# Altium schematic sheet Analog Voltmeter.SchDoc
size A2; SheetNumber: 1; SheetTotal: 1
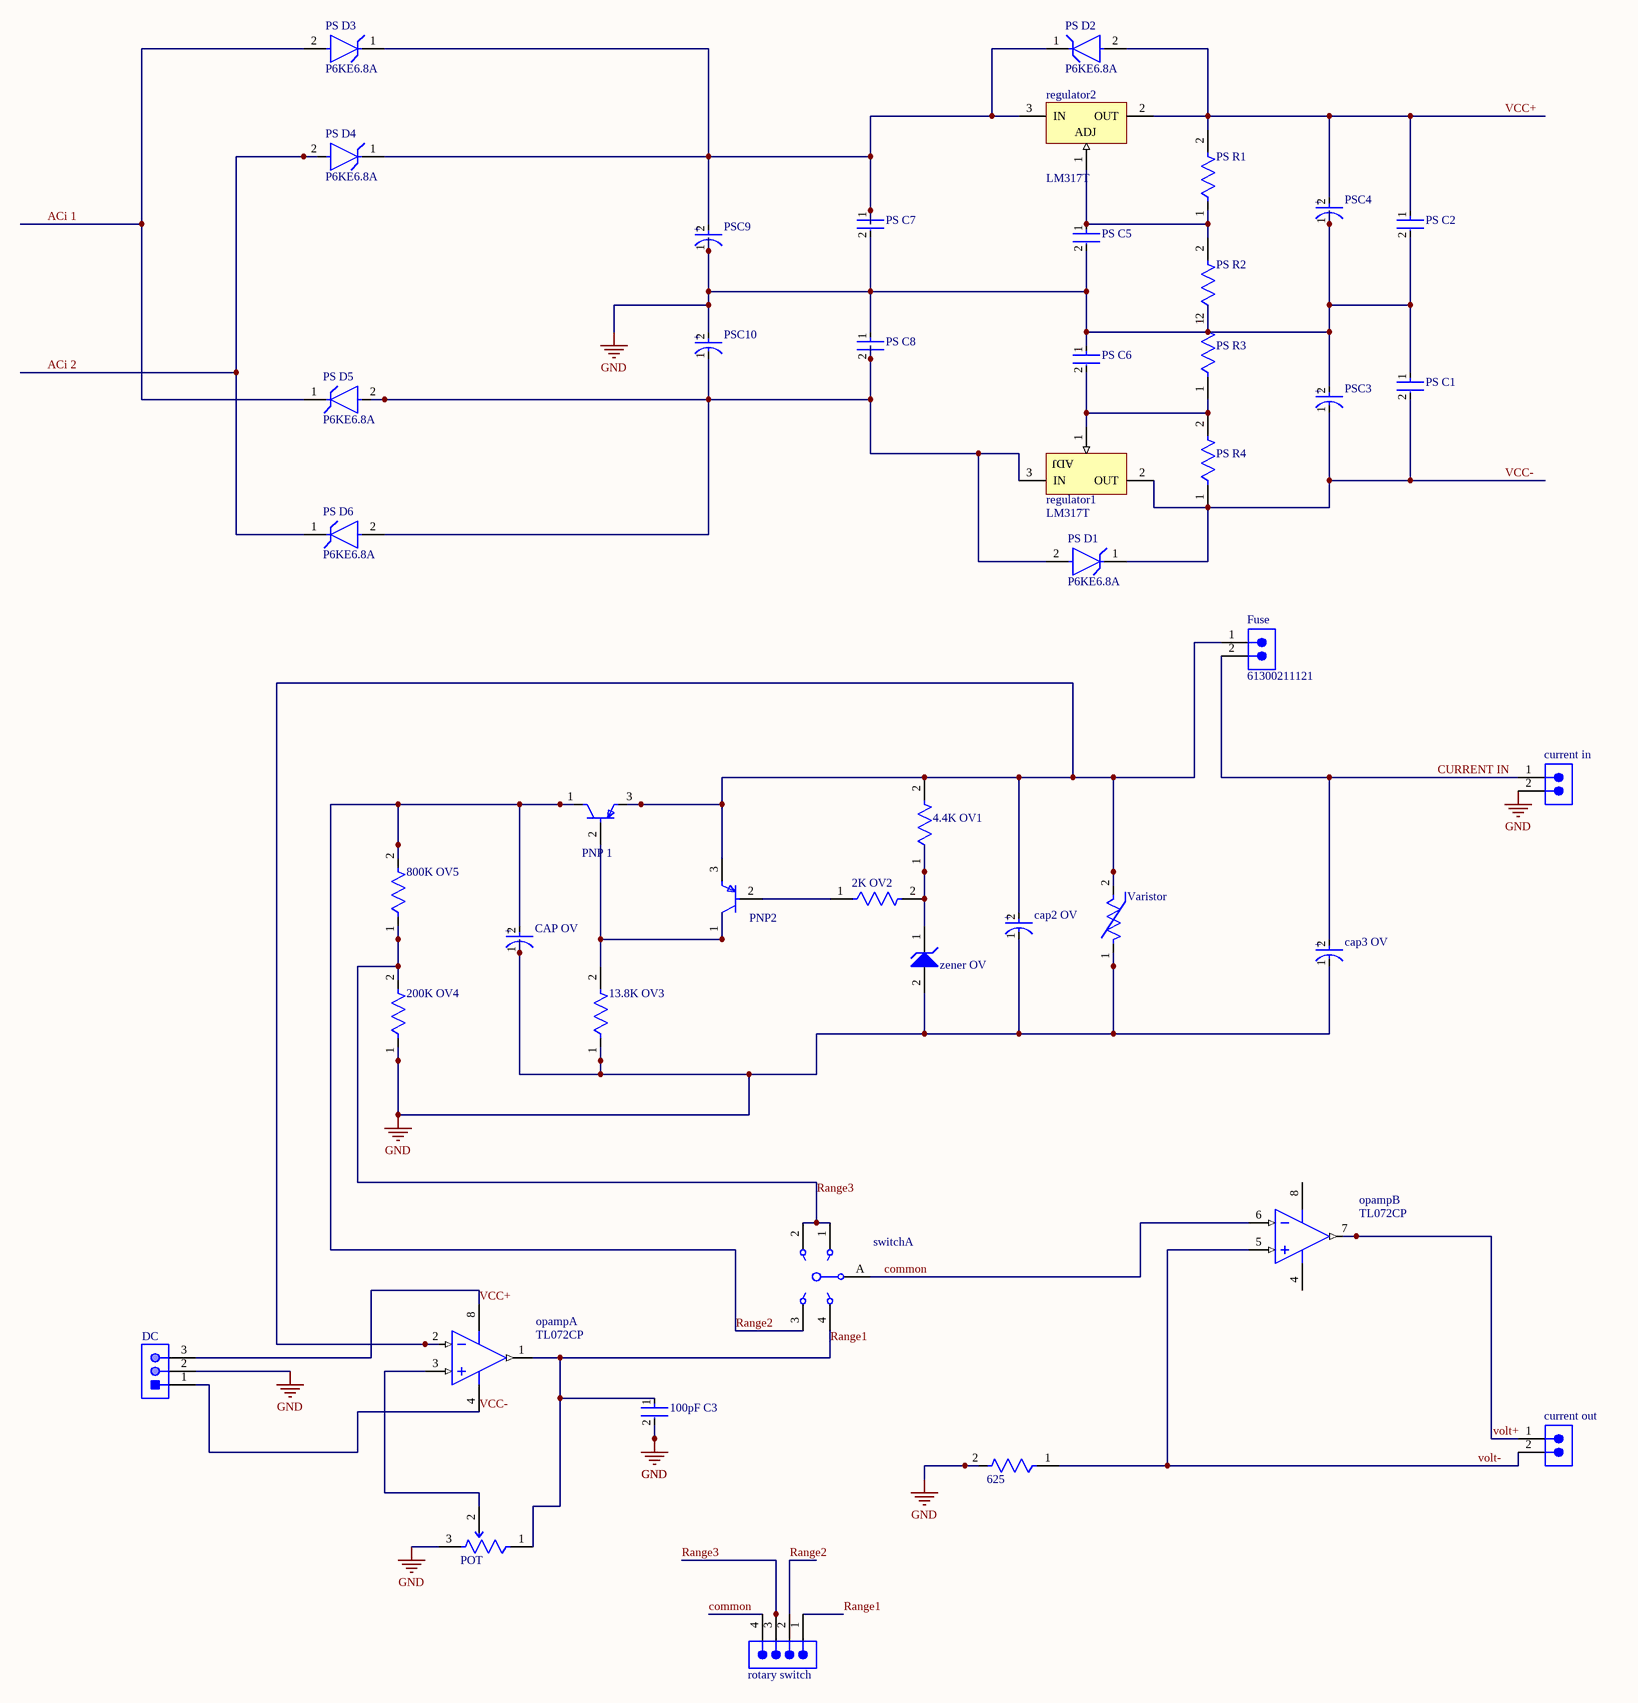
[diagram p0: Analog Voltmeter.SchDoc]

## Parts
2K_OV2  MRS25000C1002FCT00  [FP-MRS25-MFG]  (value not drawn)
4.4K_OV1  MRS25000C1002FCT00  [FP-MRS25-MFG]  (value not drawn)
13.8K_OV3  MRS25000C1002FCT00  [FP-MRS25-MFG]  (value not drawn)
100pF_C3  K104K15X7RF5TH5  [FP-K15H5-MFG]  (value not drawn)
200K_OV4  MRS25000C1002FCT00  [FP-MRS25-MFG]  (value not drawn)
625  MRS25000C1002FCT00  [FP-MRS25-MFG]  (value not drawn)
800K_OV5  MRS25000C1002FCT00  [FP-MRS25-MFG]  (value not drawn)
cap2_OV  ESL107M050AGMAA  [FP-ESLGM-MFG]  (value not drawn)
cap3_OV  ESL107M050AGMAA  [FP-ESLGM-MFG]  (value not drawn)
CAP_OV  ESL107M050AGMAA  [FP-ESLGM-MFG]  (value not drawn)
current_in  61300211121  [61300211121]  (value not drawn)
current_out  61300211121  [61300211121]  (value not drawn)
DC  22-28-4033  [MOLX-22-28-4033_V]  (value not drawn)
Fuse  61300211121  [61300211121]
opamp  TL072CP  [P0008A]  (parts A,B of 2)
PNP2  BC558BTA  [FP-135AR-MFG]  (value not drawn)
PNP_1  BC558BTA  [FP-135AR-MFG]  (value not drawn)
POT  3362P-1-503TLF  [FP-3362P-1-503TLF-MFG]  (value not drawn)
PS_C1  K104K15X7RF5TH5  [FP-K15H5-MFG]  (value not drawn)
PS_C2  K104K15X7RF5TH5  [FP-K15H5-MFG]  (value not drawn)
PS_C5  K104K15X7RF5TH5  [FP-K15H5-MFG]  (value not drawn)
PS_C6  K104K15X7RF5TH5  [FP-K15H5-MFG]  (value not drawn)
PS_C7  K104K15X7RF5TH5  [FP-K15H5-MFG]  (value not drawn)
PS_C8  K104K15X7RF5TH5  [FP-K15H5-MFG]  (value not drawn)
PS_D1  P6KE6.8A  [FP-P6KE-MFG]
PS_D2  P6KE6.8A  [FP-P6KE-MFG]
PS_D3  P6KE6.8A  [FP-P6KE-MFG]
PS_D4  P6KE6.8A  [FP-P6KE-MFG]
PS_D5  P6KE6.8A  [FP-P6KE-MFG]
PS_D6  P6KE6.8A  [FP-P6KE-MFG]
PS_R1  MRS25000C1002FCT00  [FP-MRS25-MFG]  (value not drawn)
PS_R2  MRS25000C1002FCT00  [FP-MRS25-MFG]  (value not drawn)
PS_R3  MRS25000C1002FCT00  [FP-MRS25-MFG]  (value not drawn)
PS_R4  MRS25000C1002FCT00  [FP-MRS25-MFG]  (value not drawn)
PSC3  ESL107M050AGMAA  [FP-ESLGM-MFG]  (value not drawn)
PSC4  ESL107M050AGMAA  [FP-ESLGM-MFG]  (value not drawn)
PSC9  ESL107M050AGMAA  [FP-ESLGM-MFG]  (value not drawn)
PSC10  ESL107M050AGMAA  [FP-ESLGM-MFG]  (value not drawn)
regulator1  LM317T  [TO-220]
regulator2  LM317T  [TO-220]
rotary_switch  61300411121  [61300411121]  (value not drawn)
switch  A30415RNCQ  [CKCP-A30415RNCQ-15_V]  (value not drawn)  (part A of 3)
Varistor  MOV-10D201KTR  [FP-MOV-10D201KTR-MFG]  (value not drawn)
zener_OV  1N5347BRLG  [ONSC-SURMETIC40-2-017AA-01]  (value not drawn)

## Nets
GND: 13.8K_OV3.1 100pF_C3.2 200K_OV4.1 625.2 cap2_OV.1(C) cap3_OV.1(C) CAP_OV.1(C) current_in.2 DC.2 POT.3(CW) PS_C1.1 PS_C2.2 PS_C5.2 PS_C6.1 PS_C7.2 PS_C8.1 PS_R2.1 PS_R3.2 PSC3.2(A) PSC4.1(C) PSC9.1(C) PSC10.2(A) Varistor.1 zener_OV.2(A)
ACi 1: PS_D3.2(A) PS_D5.1(C)
ACi 2: PS_D4.2(A) PS_D6.1(C)
common: opamp.6(IN2-) rotary_switch.4 switch.A
CURRENT IN: cap3_OV.2(A) current_in.1 Fuse.2
Range1: 100pF_C3.1 opamp.1(OUT1) POT.1(CCW) rotary_switch.1 switch.4
Range2: 800K_OV5.2 CAP_OV.2(A) PNP_1.1(C) rotary_switch.2 switch.3
Range3: 200K_OV4.2 800K_OV5.1 rotary_switch.3 switch.1 switch.2
VCC+: DC.3 opamp.8(VCC+) PS_C2.1 PS_D2.2(A) PS_R1.2 PSC4.2(A) regulator2.2(OUT)
VCC-: DC.1 opamp.4(VCC-) PS_C1.2 PS_D1.1(C) PS_R4.1 PSC3.1(C) regulator1.2(OUT)
volt+: current_out.1 opamp.7(OUT2)
volt-: 625.1 current_out.2 opamp.5(IN2+)
Net2K_OV2_1: 2K_OV2.1 PNP2.2(B)
Net2K_OV2_2: 2K_OV2.2 4.4K_OV1.1 zener_OV.1(K)
Net4.4K_OV1_2: 4.4K_OV1.2 cap2_OV.2(A) Fuse.1 opamp.2(IN1-) PNP2.3(E) PNP_1.3(E) Varistor.2
Net13.8K_OV3_2: 13.8K_OV3.2 PNP2.1(C) PNP_1.2(B)
Netopamp_3: opamp.3(IN1+) POT.2(WIPER)
NetPS_C5_1: PS_C5.1 PS_R1.1 PS_R2.2 regulator2.1(ADJ)
NetPS_C6_2: PS_C6.2 PS_R3.1 PS_R4.2 regulator1.1(ADJ)
NetPS_C7_1: PS_C7.1 PS_D2.1(C) PS_D3.1(C) PS_D4.1(C) PSC9.2(A) regulator2.3(IN)
NetPS_C8_2: PS_C8.2 PS_D1.2(A) PS_D5.2(A) PS_D6.2(A) PSC10.1(C) regulator1.3(IN)

## Notes on the sheet
- (in symbol CMP-03015-000005-1) +

## Library data of the parts
2K_OV2 4.4K_OV1 13.8K_OV3 200K_OV4 625 800K_OV5 PS_R1-PS_R4 = CMP-00030-42632392-1: MRS25000C1002FCT00 Resistor, 10 kOhm, ± 1%, 600 mW, Axial Leaded, Metal Film (Thin Film), Professional; Power Rating: 600mW; Voltage Rating (DC): 350V; Lead Length: 26mm; Resistance: 10kΩ; Temperature Coefficient: 50ppm/°C; Termination: Axial; Number of Terminations: 2; Diameter: 2.5mm; Composition: Metal Film, Thin Film; Number of Pins: 2; Length: 6.5mm; Military Standard: Not; RoHS: Compliant; NexarPartId: 42632392; Width: 2.5mm; Radiation Hardening: No; Voltage Rating: 350V; Max Power Dissipation: 600mW; Min Operating Temperature: -55°C; Lead Free: Lead Free; Max Operating Temperature: 155°C; Tolerance: 1%; Schedule B: 8533210090, 8533210090; Contact Plating: Tin; Mount: Through Hole; REACH SVHC: Unknown; Case/Package: Conformal
100pF_C3 PS_C1 PS_C2 PS_C5-PS_C8 = CMP-02417-000078-1: CAP CER 0.1UF 50V X7R RADIAL; Capacitance: 100nF; Tolerance: 10%; Dielectric Material: Ceramic; Lead Length: 30mm; Lead Diameter: 0.5mm; Lead/Base Style: Formed Leads; Diameter: 500um; Max Operating Temperature: 125°C; Case/Package: Dipped; Dielectric: X7R; Lead Free: Lead Free; Construction: RADIAL; Voltage: 50V; Thickness: 2.6mm; Min Operating Temperature: -55°C; Lead Pitch: 5mm; Height: 4mm; Radiation Hardening: No; Voltage Rating: 50V; Depth: 2.5mm; Voltage Rating (DC): 50V; Package Quantity: 1; Weight: 0.005644oz; Series: K; Mount: Through Hole; Termination: Radial; Height - Seated (Max): 0.257inch; Length: 4mm; Packaging: Tape and Reel; Width: 2.5mm; RoHS Compliant: Yes
cap2_OV cap3_OV CAP_OV PSC3 PSC4 PSC9 PSC10 = CMP-03015-000005-1: CAP ALUM 100UF 20% 50V THRU HOLE; Manufacturer: KEMET; Esr: 0.12Ω; Ripple Current: 725mA; Life: 10000Hours; Leakage Current: 50uA; Dissipation Factor: 10%; Tolerance: 20%; Temperature Range High: +105°C; Automotive: No; Value: 100uF; Device Class L2: Capacitors; Lead Free: Yes; Octopart: https://octopart.com/esl107m050agmaa-kemet-84758890; Height: 13.5mm; ComponentLink2Description: Datasheet; Capacitance: 100uF; Package: ESLGM; RoHS: TRUE; Digikey Description: CAP ALUM 100UF 20% 50V THRU HOLE; Temperature Range Low: -40°C; Manufacturer Part Number: ESL107M050AGMAA; Device Class L1: Passive Components; Device Class L3: Aluminum Electrolytic Capacitors; Material: Aluminum; Voltage Rating: 50V; Temperature: -40°C to +105°C; Category: Cap; ComponentLink2URL: https://content.kemet.com/datasheets/KEM_A4074_ESL.pdf
current_in current_out Fuse = CMP-1712-00002-6: NexarPartId: 20081794; Number of Contacts: 2; Pitch: 2.54mm; Connector Type: Male Pin; Voltage Rating: 250V; Current Rating: 3A; Gender: Male; Contact Resistance: 20mΩ; Height: 8.94mm; Lead Free: Lead Free; Number of Pins: 2; Termination: Through Hole; RoHS: Compliant; Lead Pitch: 2.54mm; REACH SVHC: No SVHC; Housing Material: PBT; Contact Mating Length: 5.9944mm; Min Operating Temperature: -40°C; Orientation: Vertical; Contact Material: Copper; Contact Gender: Male; Max Operating Temperature: 125°C; Number of Rows: 1; Number of Positions: 2; Packaging: Bulk; Contact Plating: Gold; Mount: Through Hole; Color: Black; Operating Supply Voltage: 250V
DC = CMP-1676-00001-5: Male Header, Pitch 2.54 mm, 1 x 3 Position, Height 8.38 mm, Tail Length 3.18 mm, RoHS, Bulk; Manufacturer: Molex; Rows: 1; Voltage Rating: 250 V; Current Rating: 4 A; Min Operating Temperature: 0 degC; Lead Pitch: 0.1 inch; Packaging: Bulk; Contact Finish: Gold; RoHSCompliant: true; Contact Material: Brass; PackageReference: 22-28-4033; REACH SVHC: Unknown; PackageDescription: Male Header, Pitch 2.54 mm, 1 x 3 Position, Height 8.38 mm, Tail Length 3.18 mm; ComponentLink2URL: http://www.molex.com/pdm_docs/sd/022284033_sd.pdf; Height: 8.38 mm; Mounting Technology: Through Hole; ComponentLink1Description: Manufacturer URL; Length: 7.62 mm; Mount: Through Hole; DatasheetVersion: Rev. G, 01/2012; Max Operating Temperature: 75 degC; ComponentLink2Description: Datasheet; Colour: Black; Pins: 3; Contact Plating: Gold; Package Quantity: 1; ComponentLink1URL: http://www.molex.com/
opamp = CMP-0017-00950-2: Dual Low-Noise JFET-Input General-Purpose Operational Amplifier, 7 to 36 V, 0 to 70 degC, 8-pin DIP (P8), Pb-Free (RoHS); Manufacturer: Texas Instruments; Sub Family: General Purpose Amplifier, High Supply Voltage Amplifier (>=30V); Total Supply Voltage(Max)(+5V is 5, +/-5V is 10): 36; Slew Rate(Typ)(V/us): 13; Vn at 1kHz(Typ)(nV/rtHz): 18; GBW(Typ)(MHz): 3; CMRR(Min)(dB): 70; Total Supply Voltage(Min)(+5V is 5, +/-5V is 10): 7; Vio (25C)(Max)(mV): 10; Rating: Catalog; IIB(Max)(pA): 200; Iq per channel(Max)(mA): 2.5; Number of Channels: 2; Mounting Technology: Through Hole; ComponentLink3Description: Package Specification; PartNumber: TL072CP; PackageVersion: 4040082/E, 04/2010; Eco-Plan: Pb-Free (RoHS); DatasheetVersion: SLOS080J; Offset Drift(Typ)(uV/C): 18; ComponentLink3URL: http://www.ti.com/litv/pdf/mpdi001b; PackageDescription: 8-Pin Plastic In-Line, Body 9.59 x 6.35 mm, Pitch 2.54 mm; Code_JEDEC: MS-001; ComponentLink2URL: http://www.ti.com/lit/ds/symlink/tl072.pdf; ComponentLink1Description: Manufacturer URL; ComponentLink2Description: Datasheet; ComponentLink1URL: http://www.ti.com/; PackageReference: P0008A
PNP2 PNP_1 = CMP-00278-84408946-1: BC558BTA Small Signal Bipolar Transistor, 0.1A I(C), 30V V(BR)CEO, 1-Element, PNP, Silicon, TO-92; Collector Emitter Saturation Voltage: -250mV; Transition Frequency: 150MHz; Emitter Base Voltage (VEBO): -5V; Max Power Dissipation: 500mW; Collector Base Voltage (VCBO): -30V; Max Junction Temperature (Tj): 150°C; Max Frequency: 10MHz; Current Rating: -100mA; Number of Elements: 1; Element Configuration: Single; hFE Min: 110; Max Operating Temperature: 150°C; Weight: 240mg; RoHS: Compliant; Lead Free: Lead Free; REACH SVHC: No SVHC; NexarPartId: 84408946; Number of Pins: 3; Voltage Rating (DC): -30V; Width: 4.19mm; Max Breakdown Voltage: 30V; Case/Package: TO-92; Mount: Through Hole; Frequency: 150MHz; Collector Emitter Voltage (VCEO): -30V; Height: 5.33mm; Schedule B: 8541210080; Length: 5.2mm; Max Collector Current: -100mA; Collector Emitter Breakdown Voltage: 30V; Polarity: PNP; Contact Plating: Tin; Min Operating Temperature: -65°C; Power Dissipation: 500mW; Gain Bandwidth Product: 150MHz
POT = CMP-07234-000028-1: TRIMMER 50K OHM 0.5W PC PIN TOP; Temperature Coefficient: 100ppm/°C; Voltage Rating (DC): 300V; Resistance: 50kR; Power Rating: 500mW; Tolerance: 10%; Number of Turns: 1; Series: Trimpot® 3362 - Sealed; Military Standard: Not; Termination: Pin; Technology: CERMET; Depth: 7.04mm; RoHS Compliant: Yes; Max Operating Temperature: 125°C; Lead Free: Lead Free; Max Power Dissipation: 500mW; REACH SVHC: No SVHC; Min Operating Temperature: -55°C; Resistor Type: Cermet; Height: 0.185inch; Width: 4.7mm; Mount: Through Hole; Weight: 0.02oz; Length: 6.6mm; Resistance Tolerance: 10%; Package Quantity: 50; Radiation Hardening: No; Packaging: Rail/Tube
PS_D1-PS_D6 = CMP-08607-000072-1: TVS DIODE 5.8V 10.5V DO204AC; Manufacturer: Littelfuse Inc; Peak Pulse Power: 600W; Max Junction Temp: +175°C; Peak Pulse Current: 58.1A; Number Of Channels: 1; Direction: Unidirectional; Breakdown Voltage: 6.45V; Mouser Description: TVSS; Diode; For Data/Comm; Industrial Equip; 58.1A; Thru-Hole; Solder Term; Height: 3.6mm; RoHS: TRUE; Lead Free: Yes; Category: Diode; ComponentLink2Description: Datasheet; Manufacturer Part Number: P6KE6.8A; Package: P6KE; Temperature Range Low: -55°C; Device Class L3: unset; Digikey Description: TVS DIODE 5.8V 10.5V DO204AC; Temperature Range High: +175°C; Automotive: No; Clamping Voltage: 10.5V; Ipc Land Pattern Name: DIOPA1328W105L760D360; Octopart: https://octopart.com/p6ke6.8a-littelfuse-20808; ComponentLink2URL: https://www.littelfuse.com/~/media/electronics/datasheets/tvs_diodes/littelfuse_tvs_diode_p6ke_datasheet.pdf.pdf; Temperature: -55°C to +175°C; Device Class L2: TVS Diodes; Device Class L1: Circuit Protection; Reverse Standoff Voltage: 5.8V
regulator1 regulator2 = CMP-0244-00444-1: 1.5A, 1.2V to 37V Adjustable Voltage Regulator, 3-Pin TO-220; PackageVersion: 2011; ComponentLink1URL: http://www.st.com; ComponentLink2URL: http://www.st.com/internet/com/TECHNICAL_RESOURCES/TECHNICAL_LITERATURE/DATASHEET/CD00000455.pdf; PackageDescription: TO, Thru-Hole, Vertical, Heatsink Mounted; 3 In-Line Leads; Pitch 2.54 mm; PackageReference: TO-220; ComponentLink1Description: Manufacturer URL; ComponentLink3URL: http://www.st.com/internet/com/TECHNICAL_RESOURCES/TECHNICAL_LITERATURE/PACKAGE_INFORMATION/CD00004649.pdf; DatasheetVersion: 1/11/2011; ComponentLink2Description: Datasheet; ComponentLink3Description: Package Specification
rotary_switch = CMP-1502-01064-3: NexarPartId: 32855522; Operating Supply Voltage: 250V; Pitch: 2.54mm; Contact Resistance: 20mΩ; Number of Positions: 4; Current Rating: 3A; Connector Type: Male Pin; Gender: Male; Contact Plating: Gold; Height: 8.89mm; Lead Pitch: 2.54mm; Lead Free: Lead Free; Contact Mating Length: 5.9944mm; Number of Rows: 1; Termination: Solder; Packaging: Bulk; REACH SVHC: Unknown; Min Operating Temperature: -40°C; RoHS: Compliant; Number of Contacts: 4; Voltage Rating: 250V; Color: Black; Max Operating Temperature: 105°C; Contact Material: Copper; Mount: Through Hole; Orientation: Vertical; Number of Pins: 4
switch = CMP-1076-00010-1: A Series Rotary Switch, 3 Poles, 4 Positions, 30 deg Angle of Throw, -30 to 85 degC, RoHS; Manufacturer: C&K Components; Angle of Throw: 30 deg; Position: 4; Pole: 3; PartNumber: A30415RNCQ; ComponentLink2URL: http://www.ck-components.com/13397/arotary_9apr14.pdf/; ComponentLink3URL: http://www.ck-components.com/13397/arotary_9apr14.pdf/; ComponentLink1Description: Manufacturer URL; PackageDescription: 15-Pin Through Hole Device, Dia 26.19 mm, Height 60.59 mm; Temperature Range: -30 to 85 degC; PackageReference: A30415RNCQ-15; ComponentLink3Description: Package Specification; RoHS: TRUE; Series: A; ComponentLink1URL: http://www.ck-components.com/; ComponentLink2Description: Datasheet; DatasheetVersion: 41821; Mounting Technology: Through Hole
Varistor = CMP-07402-000009-1: VARISTOR 200V 2.5KA DISC 10MM; Manufacturer: Bourns Inc.; Voltage Rating Ac: 130V; Varistor Voltage: 185V; Voltage Rating Dc: 170V; Voltage Tolerance: 10%; Clamping Voltage: 340V; Capacitance: 600pF; Clamping Current: 25A; Value: 600pF; Device Class L2: Varistors; Automotive: No; Octopart: https://octopart.com/mov-10d201ktr-bourns-19184757; Temperature: -40°C to +105°C; RoHS: TRUE; Height: 15.5mm; Category: Res; Mouser Description: Varistors 250pF 200volts 10%; Lead Free: Yes; ComponentLink2Description: Datasheet; ComponentLink2URL: https://www.bourns.com/docs/Product-Datasheets/MOV10D.pdf; Temperature Range High: +105°C; Device Class L3: unset; Temperature Range Low: -40°C; Package: 0; Digikey Description: VARISTOR 200V 2.5KA DISC 10MM; Manufacturer Part Number: MOV-10D201KTR; Device Class L1: Circuit Protection
zener_OV = CMP-1060-01277-1: 5 W Zener Voltage Regulator, 2-Pin Surmetic(TM) 40, Pb-Free, Tape and Reel; Manufacturer: On Semiconductor; VZ Typ (V): 10; P Max (W): 5; Packing: Tape and Reel; PackageReference: SURMETIC40-2-017AA-01; ComponentLink3Description: Package Specification; PartNumber: 1N5347BRLG; ComponentLink3URL: http://www.onsemi.cn/pub_link/Collateral/017AA.PDF; PackageVersion: Rev. O, 09/2005; ComponentLink1URL: http://www.onsemi.com/; DatasheetVersion: Rev. 14; ComponentLink2URL: http://www.onsemi.cn/pub_link/Collateral/1N5333B-D.PDF; RoHS: Pb-Free; ComponentLink1Description: Manufacturer URL; PackageDescription: 2-Pin, Axial Lead, Diameter 3.49 mm; Mounting Technology: Through Hole; ComponentLink2Description: Datasheet